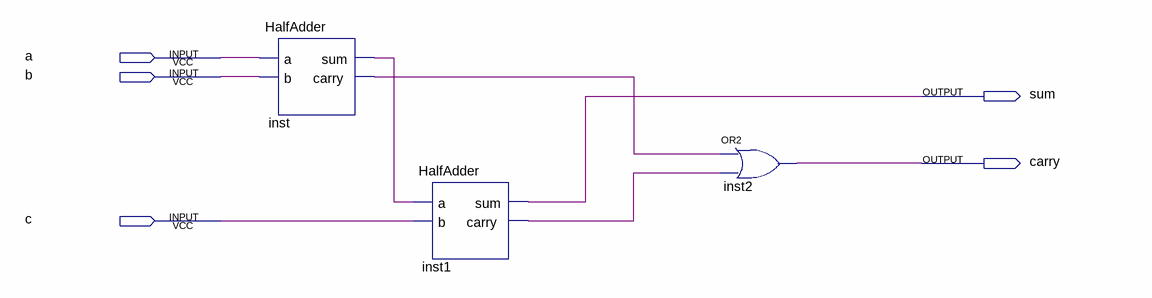
[diagram p0: schematic sheet]
// Quartus schematic FullAdder.bdf as structural Verilog: 3 symbols, 5 pins
module FullAdder (
  input  a,
  input  b,
  input  c,
  output sum,
  output carry
);

  wire inst1_carry, inst_carry, inst_sum;

  HalfAdder inst (.a(a), .b(b), .sum(inst_sum), .carry(inst_carry));
  HalfAdder inst1 (.a(inst_sum), .b(c), .sum(sum), .carry(inst1_carry));
  or inst2 (carry, inst_carry, inst1_carry);
endmodule
